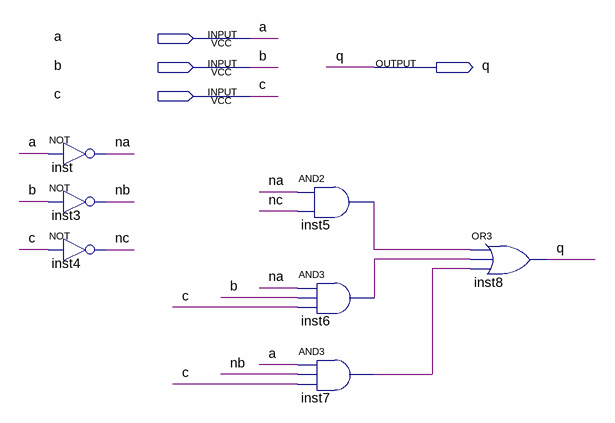
[diagram p0: schematic sheet]
// Quartus schematic s15_ks5.bdf as structural Verilog: 7 symbols, 4 pins
module s15_ks5 (
  input  a,
  input  b,
  input  c,
  output q
);

  wire inst5_out, inst6_out, inst7_out, na, nb, nc;

  not inst (na, a);
  not inst3 (nb, b);
  not inst4 (nc, c);
  and inst5 (inst5_out, na, nc);
  and inst6 (inst6_out, na, b, c);
  and inst7 (inst7_out, a, nb, c);
  or inst8 (q, inst5_out, inst6_out, inst7_out);
endmodule
